# Altium schematic sheet io.SchDoc: sensor
size 420 x 297 mm; Date: 2021-12-08; Author: Joachim Löfwander; Revision: AAA-000; SheetNumber: 4; SheetTotal: 4; Website: github.com/jlofw
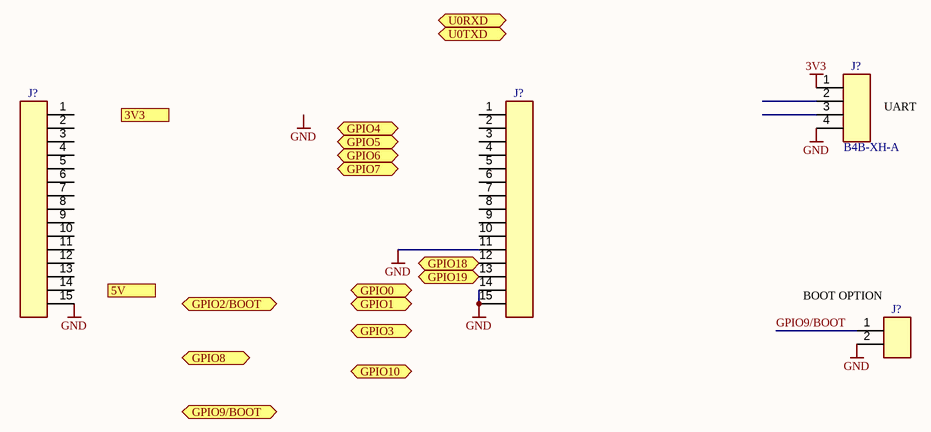
[diagram p0: io.SchDoc]

## Parts
(Parts that share a designator on the sheet are numbered #1, #2 ... from top to bottom, then left to right.)
J?#1  Manufacturer P/N: B4B-XH-A  [JST_XH_B4B-XH-A]  (hidden comment: conn_01x04)
J?#2  conn_01x15  [PinHeader_1x015_P2.54mm_Vertical]  (value not drawn)
J?#3  conn_01x15  [PinHeader_1x015_P2.54mm_Vertical]  (value not drawn)
J?#4  conn_01x02  [PinHeader_1x02_P2.54mm_Vertical]  (value not drawn)

## Ports
3V3 (in), 5V (in), GPIO0 (bidir), GPIO1 (bidir), GPIO2/BOOT (bidir), GPIO3 (bidir), GPIO4 (bidir), GPIO5 (bidir), GPIO6 (bidir), GPIO7 (bidir), GPIO8 (bidir), GPIO9/BOOT (bidir), GPIO10 (bidir), GPIO18 (bidir), GPIO19 (bidir), U0RXD (bidir), U0TXD (bidir)

## Nets
3V3: J?#1.1
GND: J?#1.4 J?#2.15 J?#3.11 J?#3.14 J?#3.15 J?#4.2
GPIO9/BOOT: J?#4.1
GPIO18: J?#3.12 ; port GPIO18
GPIO19: J?#3.13 ; port GPIO19

Not connected (* = marked no-connect by the designer): J?#1 2 3; J?#2 1 2 3 4 5 6 7 8 9 10 11 12 13 14; J?#3 1 2 3 4 5 6 7 8 9 10

## Notes on the sheet
- (near J?#1) UART
- (near J?#4) BOOT OPTION
- Labels drawn without touching a wire or pin: GND
- PROJECT
- TITLE
- FILE NAME
- DATE MODIFIED
- SHEET
- REV
- OF
- AUTHOR
- WEBSITE

## Library data of the parts
J?#1 = 110022: JST XH Vertical TH 4p; Internal Number: 110022; Manufacturer: JST
J?#2 J?#3 = 110014: 01x15 P2.54 Pin Header Vertical; Internal Number: 110014
J?#4 = 110001: 01x02 P2.54 Pin Header Vertical; Internal Number: 110001